# EAGLE design Board_v.03b (EAGLE 6.4)
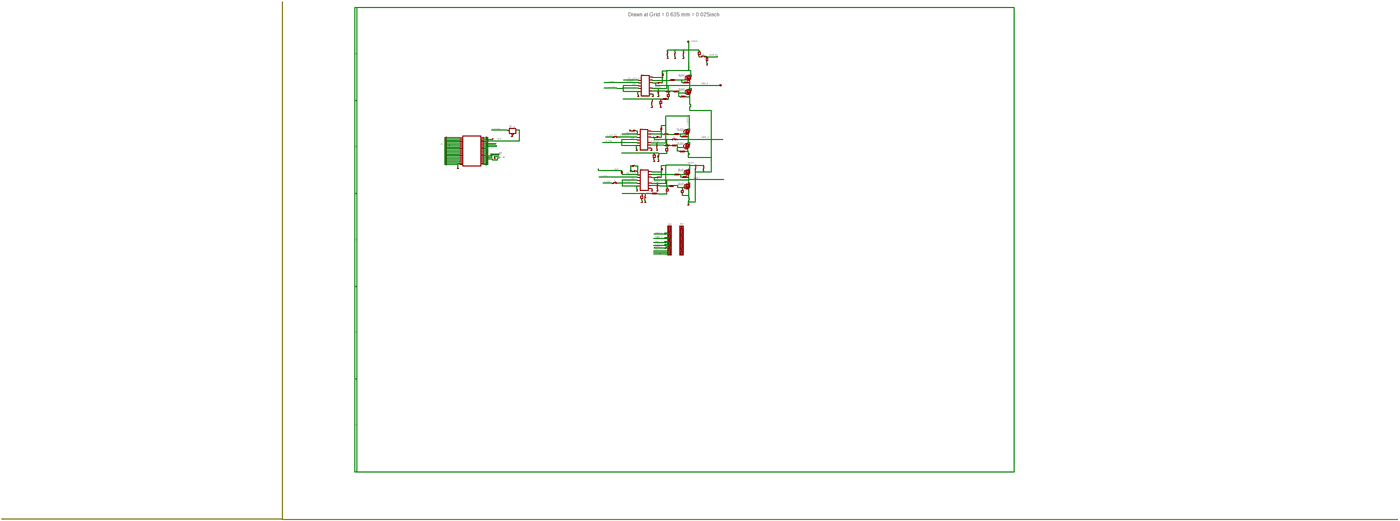
[diagram p0: schematic, sheet 1, overview]
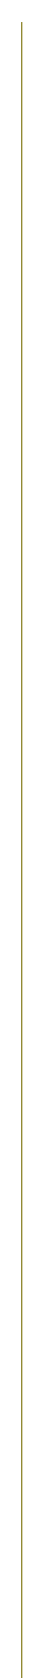
[diagram p1: schematic, sheet 1, part 1 of 7]
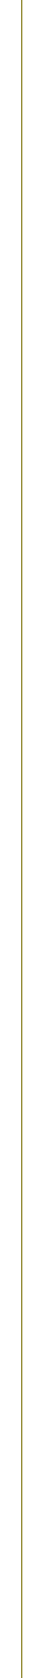
[diagram p2: schematic, sheet 1, part 2 of 7]
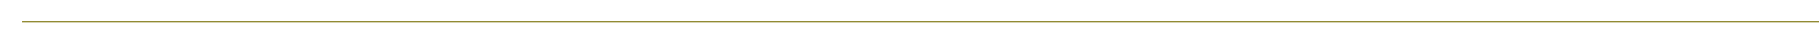
[diagram p3: schematic, sheet 1, part 3 of 7]
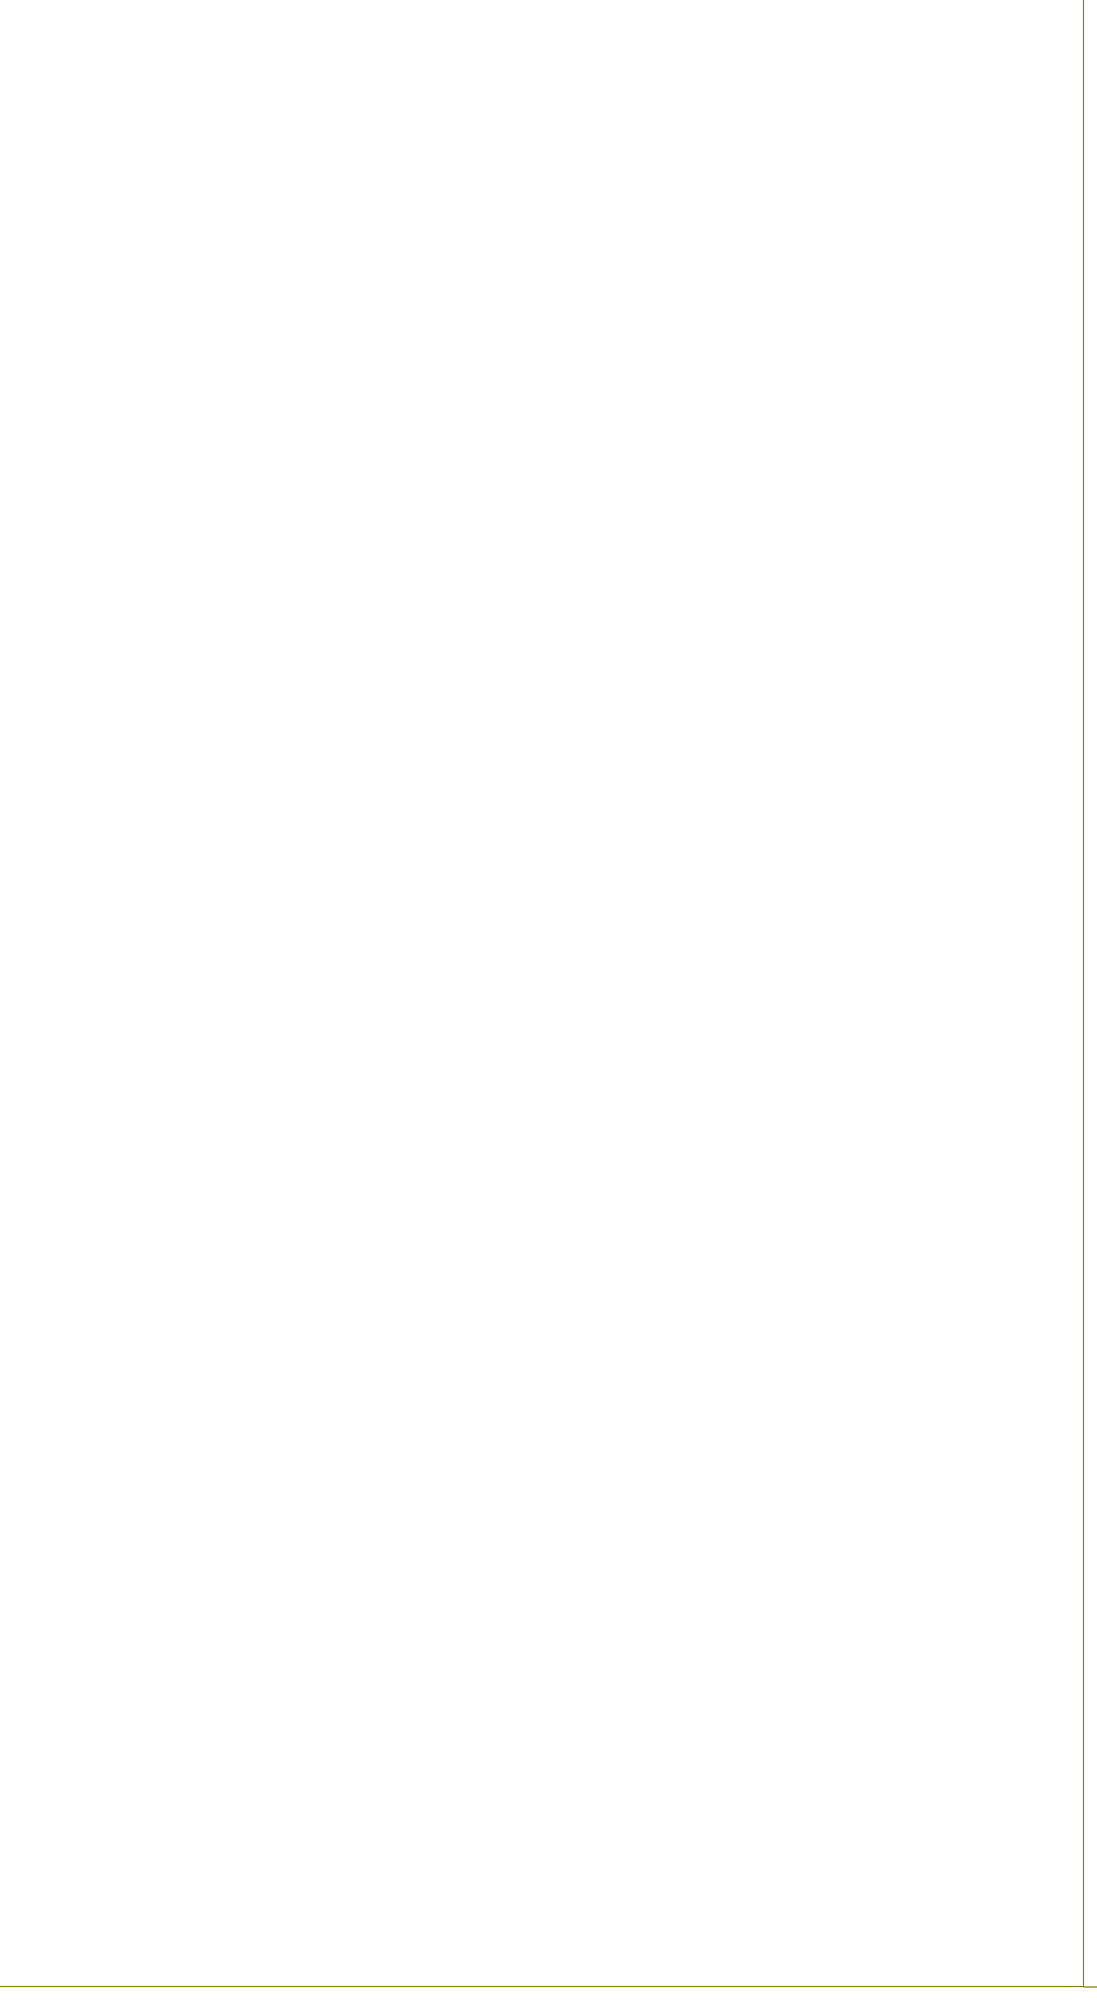
[diagram p4: schematic, sheet 1, part 4 of 7]
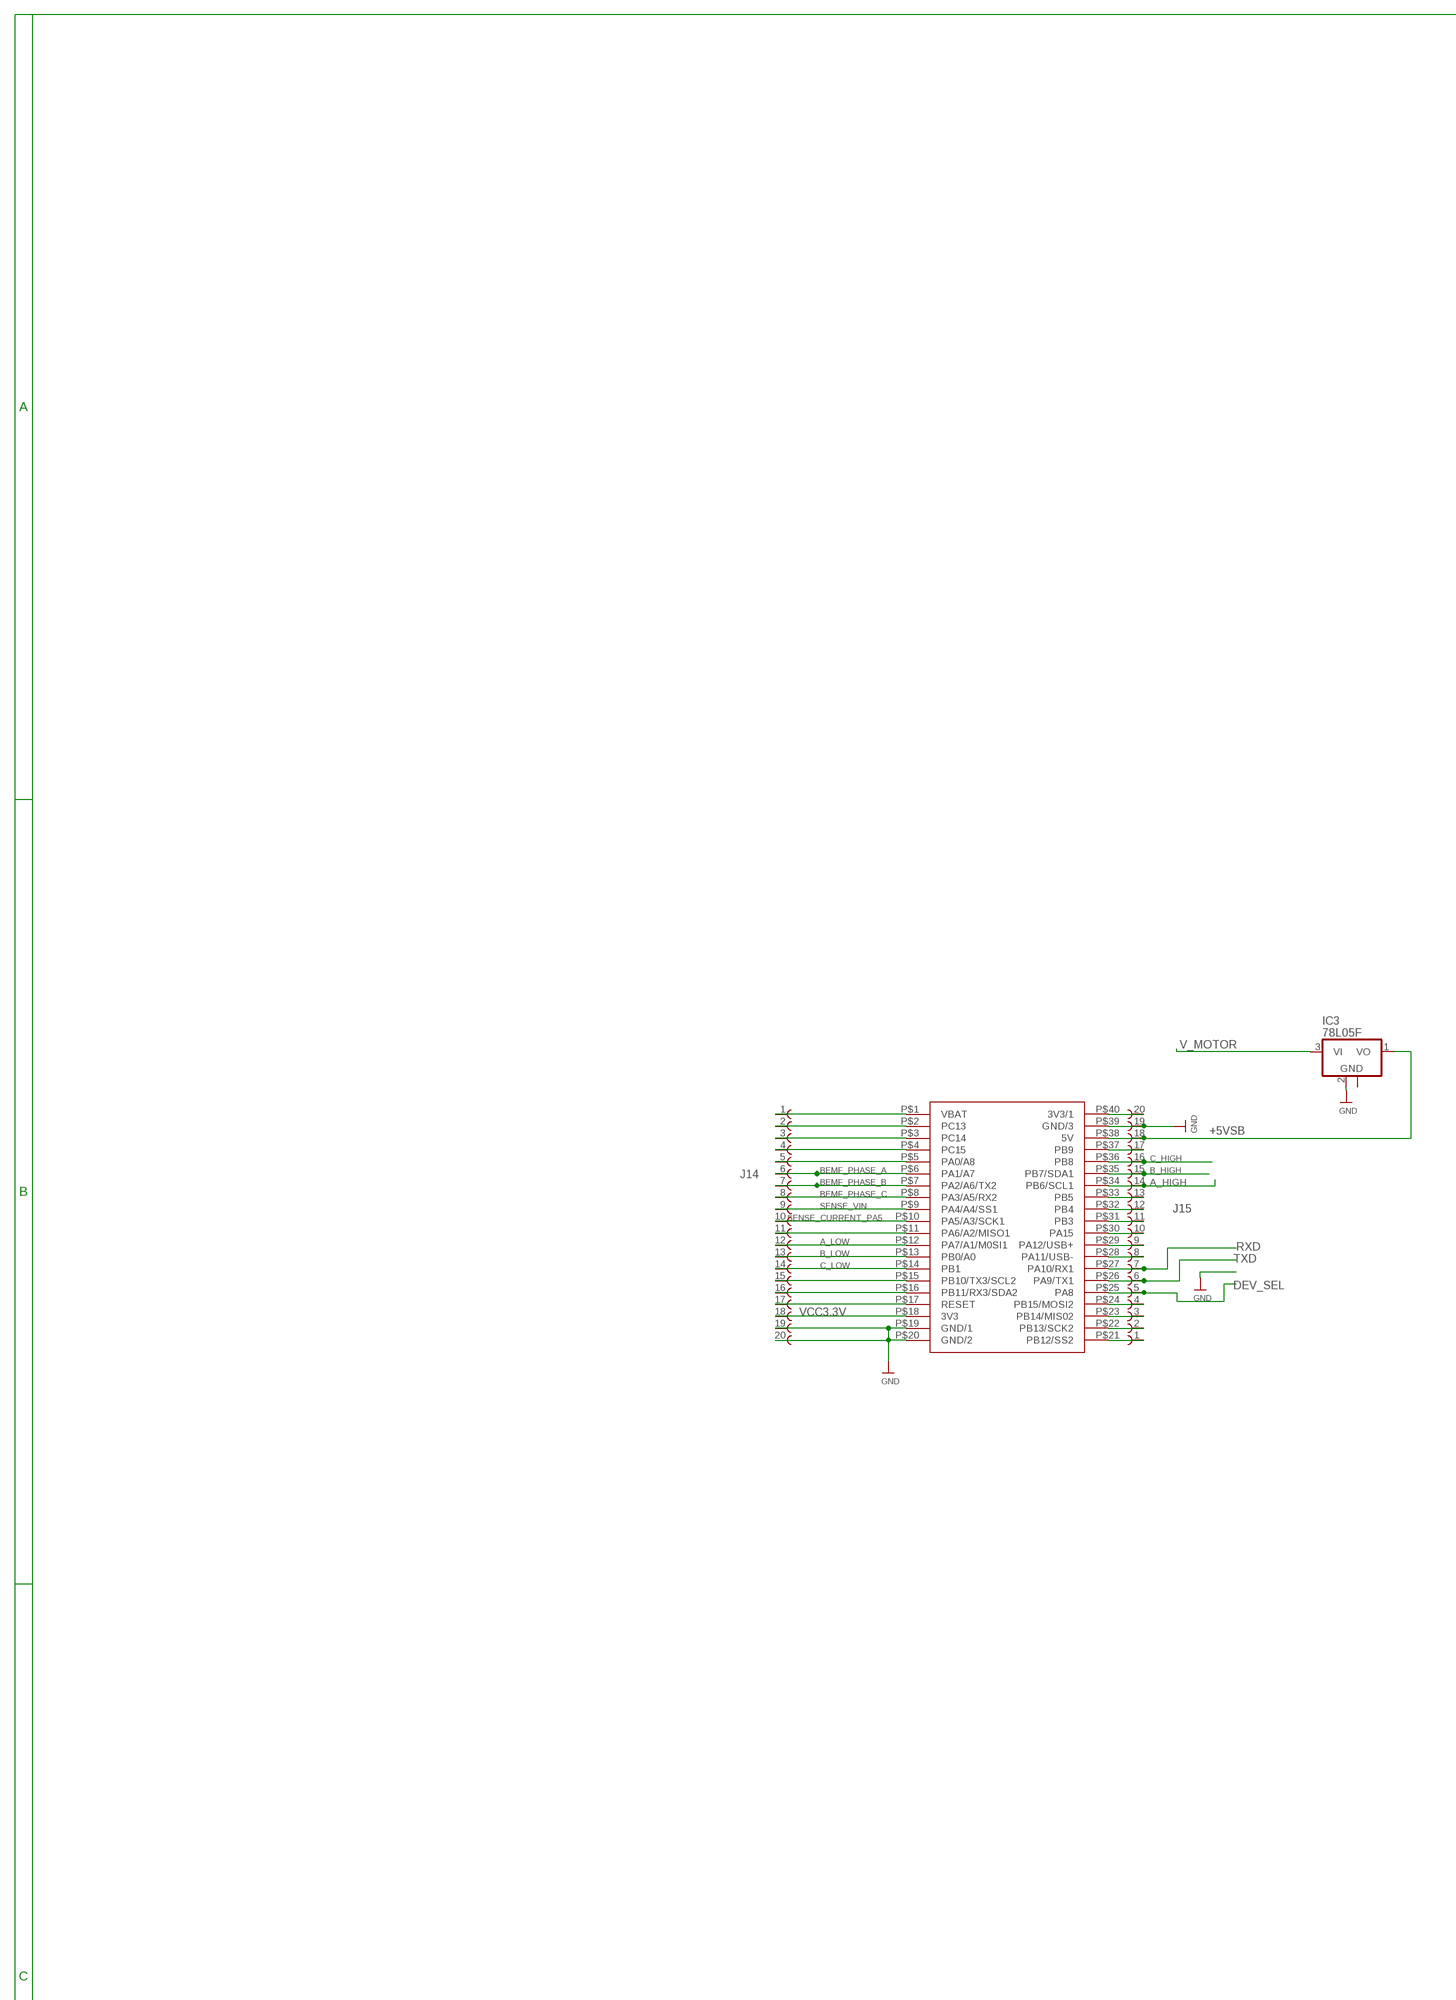
[diagram p5: schematic, sheet 1, part 5 of 7]
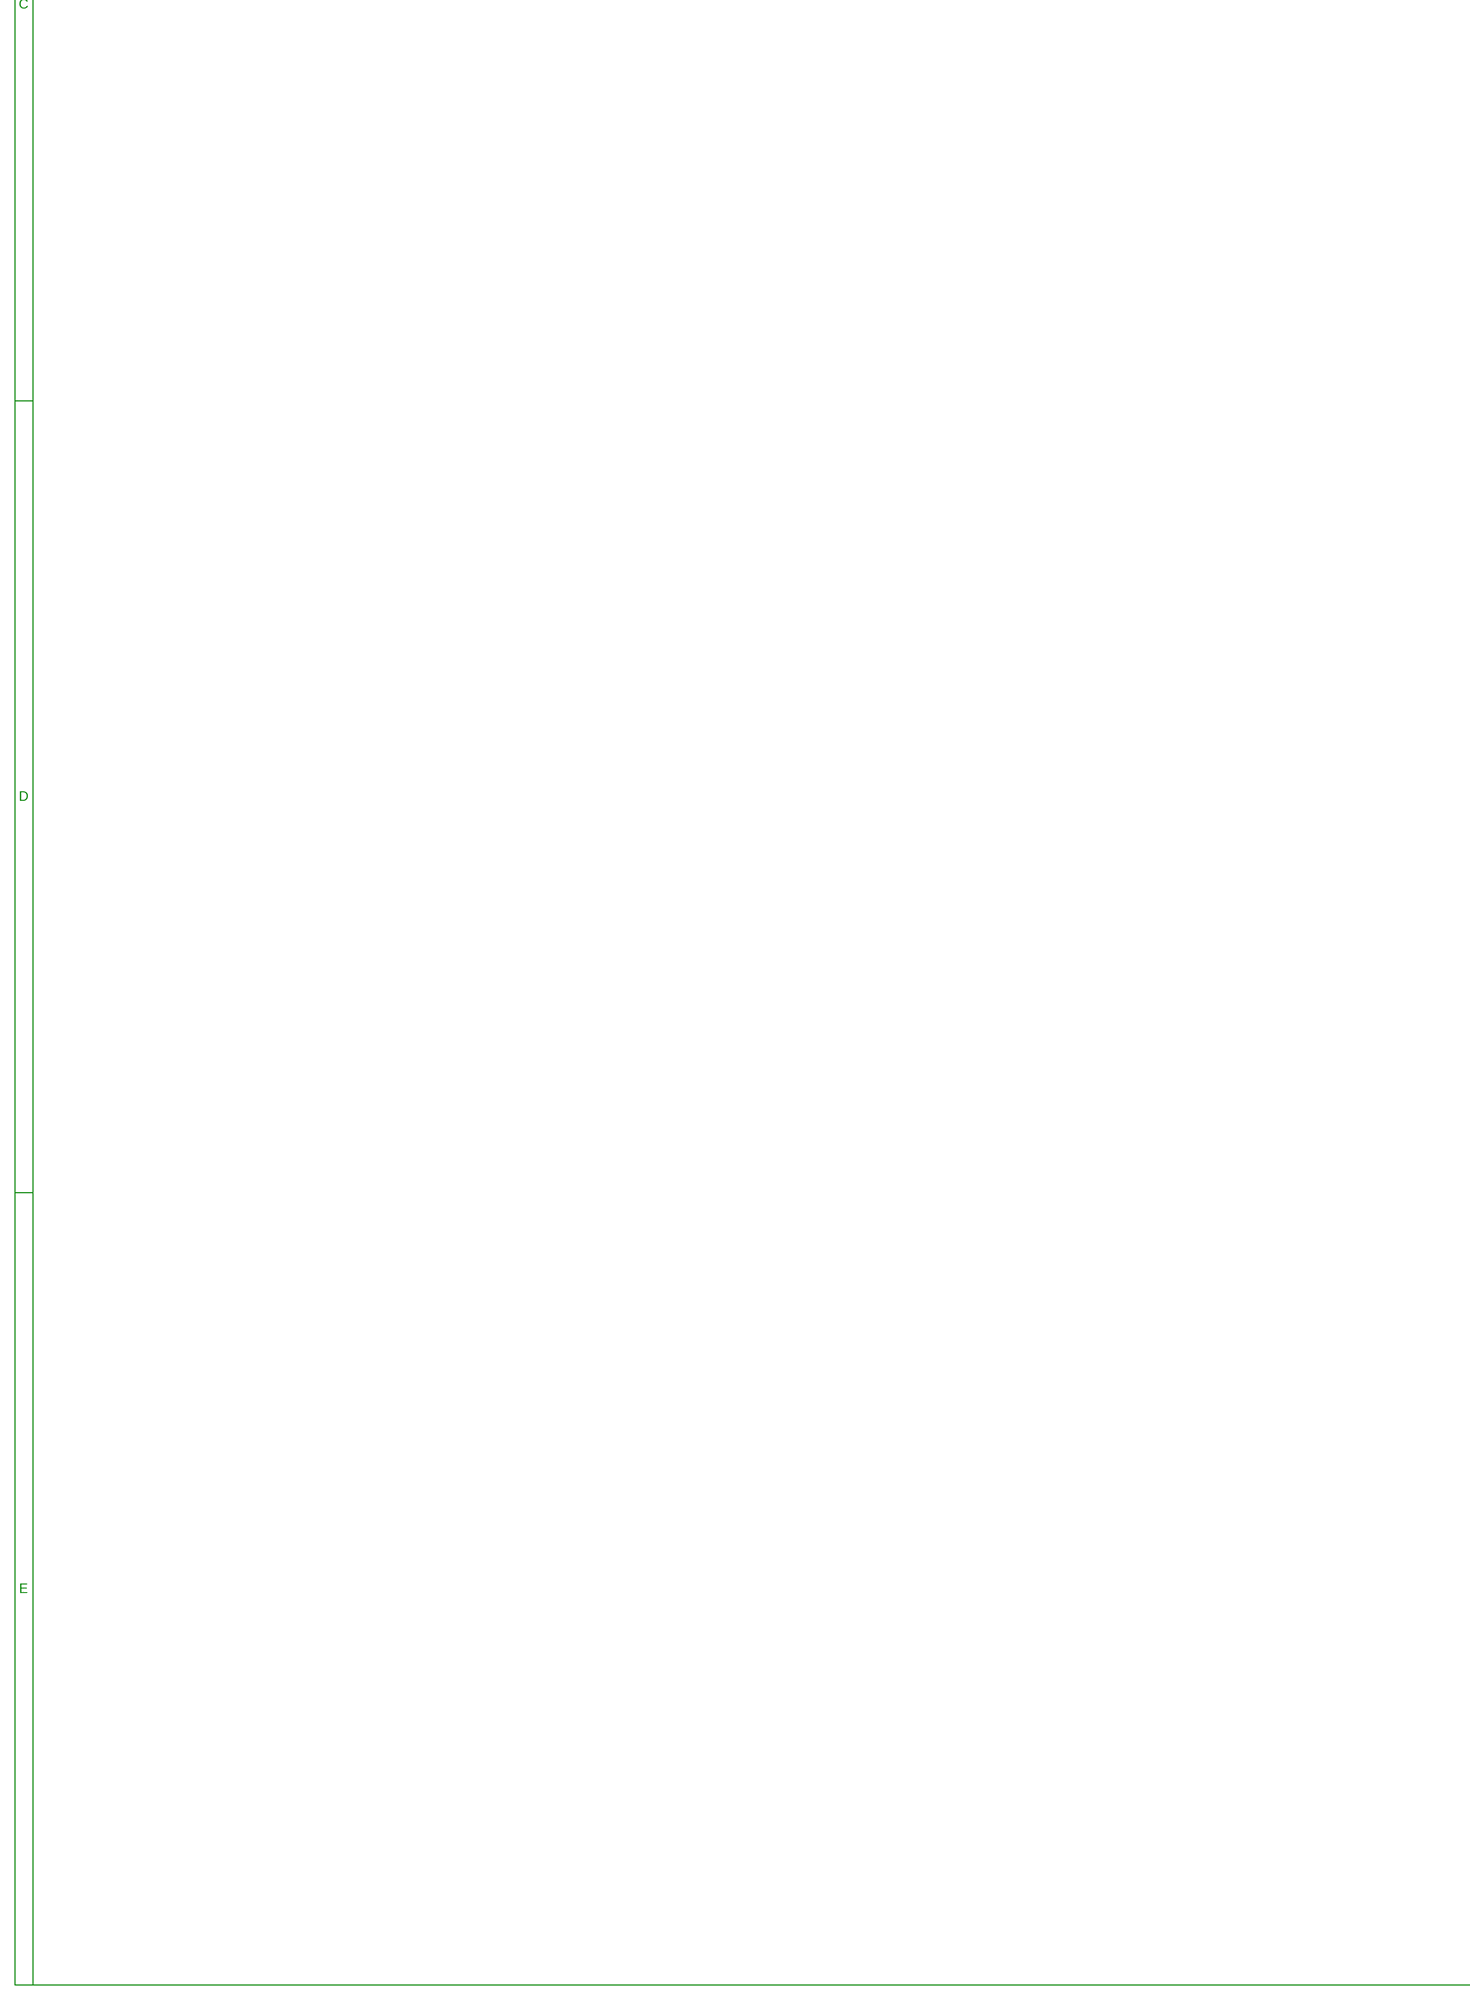
[diagram p6: schematic, sheet 1, part 6 of 7]
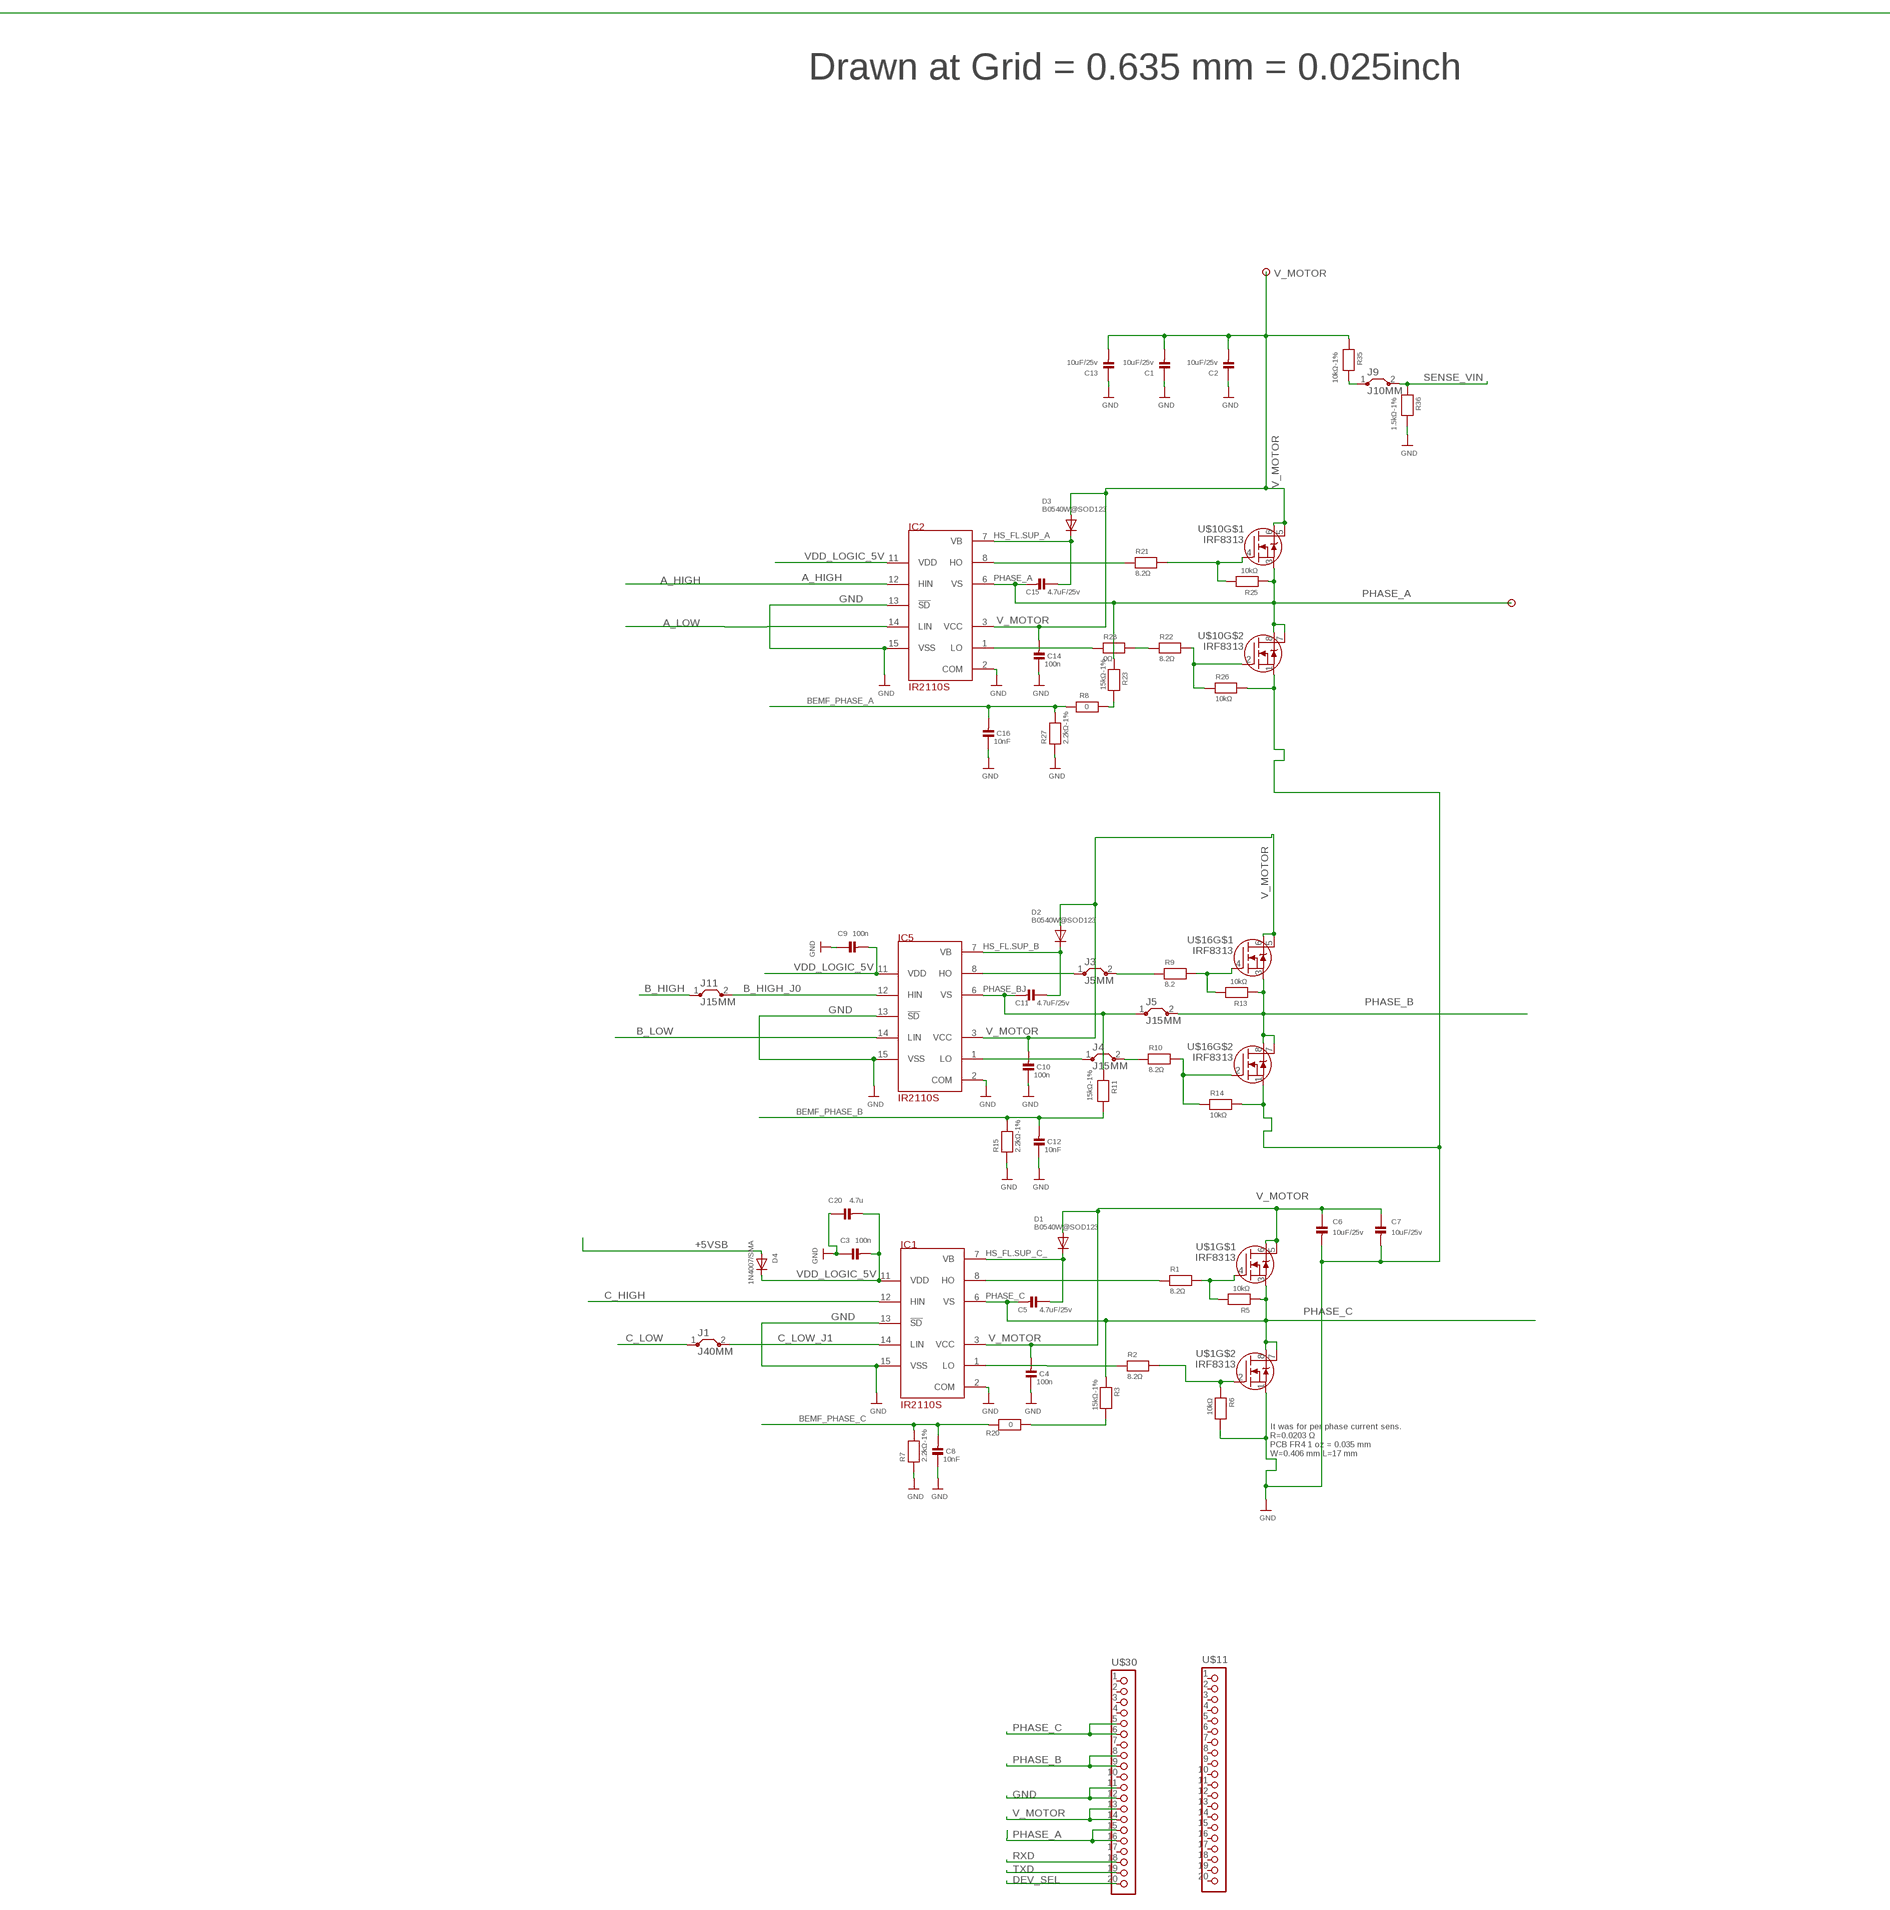
[diagram p7: schematic, sheet 1, part 7 of 7]

## Parts
C1  10uF/25v  CAP_CERAMIC_0805MP  [_0805MP]
C2  10uF/25v  CAP_CERAMIC_0805MP  [_0805MP]
C3  100n  CAP_CERAMIC_0805MP  [_0805MP]
C4  100n  CAP_CERAMIC_0603MP  [_0603MP]
C5  4.7uF/25v  CAP_CERAMIC_0805MP  [_0805MP]
C6  10uF/25v  CAP_CERAMIC_0805MP  [_0805MP]
C7  10uF/25v  CAP_CERAMIC_0805MP  [_0805MP]
C8  10nF  CAP_CERAMIC_0805MP  [_0805MP]
C9  100n  CAP_CERAMIC_0603MP  [_0603MP]
C10  100n  CAP_CERAMIC_0603MP  [_0603MP]
C11  4.7uF/25v  CAP_CERAMIC_0805MP  [_0805MP]
C12  10nF  CAP_CERAMIC_0805MP  [_0805MP]
C13  10uF/25v  CAP_CERAMIC_0805MP  [_0805MP]
C14  100n  CAP_CERAMIC_0603MP  [_0603MP]
C15  4.7uF/25v  CAP_CERAMIC_0805MP  [_0805MP]
C16  10nF  CAP_CERAMIC_0805MP  [_0805MP]
C20  4.7u  CAP_CERAMIC_0805MP  [_0805MP]
D1  B0540W@SOD123  DIODESOD-123  [SOD-123]
D2  B0540W@SOD123  DIODESOD-123  [SOD-123]
D3  B0540W@SOD123  DIODESOD-123  [SOD-123]
D4  1N4007/SMA  DIODESMA  [SMADIODE]
IC1  IR2110S  [SO-16DW]
IC2  IR2110S  [SO-16DW]
IC3  78L05F  [SOT89]
IC5  IR2110S  [SO-16DW]
J1  J40MM  [J40MM]
J3  J5MM  [05]
J4  J15MM  [15]
J5  J15MM  [15]
J9  J10MM  [10]
J11  J15MM  [15]
J14  61002013321  [CON-20PIN-SMD-MANUALLY-BENT-FROM-NON-SMD]
J15  61002013321  [CON-20PIN-SMD-MANUALLY-BENT-FROM-NON-SMD]
PHASE_C  PHASE_C  PAD  [PAD]
R1  8.2Ω  RESISTOR_0805MP  [_0805MP]
R2  8.2Ω  RESISTOR_0805MP  [_0805MP]
R3  15kΩ-1%  RESISTOR_0805MP  [_0805MP]
R5  10kΩ  RESISTOR_0805MP  [_0805MP]
R6  10kΩ  RESISTOR_0805MP  [_0805MP]
R7  2.2kΩ-1%  RESISTOR_0805MP  [_0805MP]
R8  0  RESISTOR_0805MP  [_0805MP]
R9  8.2  RESISTOR_0805MP  [_0805MP]
R10  8.2Ω  RESISTOR_0805MP  [_0805MP]
R11  15kΩ-1%  RESISTOR_0805MP  [_0805MP]
R13  10kΩ  RESISTOR_0805MP  [_0805MP]
R14  10kΩ  RESISTOR_0805MP  [_0805MP]
R15  2.2kΩ-1%  RESISTOR_0805MP  [_0805MP]
R20  0  RESISTOR_0805MP  [_0805MP]
R21  8.2Ω  RESISTOR_0805MP  [_0805MP]
R22  8.2Ω  RESISTOR_0805MP  [_0805MP]
R23  15kΩ-1%  RESISTOR_0805MP  [_0805MP]
R25  10kΩ  RESISTOR_0805MP  [_0805MP]
R26  10kΩ  RESISTOR_0805MP  [_0805MP]
R27  2.2kΩ-1%  RESISTOR_0805MP  [_0805MP]
R28  0Ω  RESISTOR_0805MP  [_0805MP]
R35  10kΩ-1%  RESISTOR_0805MP  [_0805MP]
R36  1.5kΩ-1%  RESISTOR_0805MP  [_0805MP]
U$1  IRF8313  [SO08]
U$10  IRF8313  [SO08]
U$11  CON_HEADER_1X20  [M1X20_SMD_2.54MM/0.1"_LONGTRACKS]
U$16  IRF8313  [SO08]
U$30  CON_HEADER_1X20  [M1X20_SMD_2.54MM/0.1"_LONGTRACKS]
U$36  BLUEPILL  [40-DIP-BLUE-PIL]
V_MOTOR  V_MOTOR  PAD  [PAD]

## Nets
+5VSB: D4.A IC3.1(VO) J15.18 U$36.P$38(5V)
A_HIGH: IC2.12(HIN) J15.14 U$36.P$34(PB6/SCL1)
A_LOW: IC2.14(LIN) J14.12 U$36.P$12(PA7/A1/M0SI1)
B_HIGH: J11.1 J15.15 U$36.P$35(PB7/SDA1)
B_HIGH_J0: IC5.12(HIN) J11.2
B_LOW: IC5.14(LIN) J14.13 U$36.P$13(PB0/A0)
BEMF_PHASE_A: C16.2 J14.6 R8.1 R27.2 U$36.P$6(PA1/A7)
BEMF_PHASE_B: C12.2 J14.7 R11.2 R15.2 U$36.P$7(PA2/A6/TX2)
BEMF_PHASE_C: C8.2 J14.8 R7.2 R20.2 U$36.P$8(PA3/A5/RX2)
C_HIGH: IC1.12(HIN) J15.16 U$36.P$36(PB8)
C_LOW: J1.1 J14.14 U$36.P$14(PB1)
C_LOW_J1: IC1.14(LIN) J1.2
DEV_SEL: J15.5 U$30.20 U$36.P$25(PA8)
GND: C1.1 C2.1 C3.1 C4.1 C6.2 C7.2 C8.1 C9.1 C10.1 C12.1 C13.1 C14.1 C16.1 C20.1 IC1.2(COM) IC1.13(!SD) IC1.15(VSS) IC2.2(COM) IC2.13(!SD) IC2.15(VSS) IC3.2(GND) IC5.2(COM) IC5.13(!SD) IC5.15(VSS) J14.19 J14.20 J15.19 R6.2 R7.1 R14.2 R15.1 R26.2 R27.1 R36.2 U$1.1(S) U$10.1(S) U$16.1(S) U$30.11 U$30.12 U$36.P$19(GND/1) U$36.P$20(GND/2) U$36.P$39(GND/3)
HS_FL.SUP_A: C15.1 D3.C IC2.7(VB)
HS_FL.SUP_B: C11.1 D2.C IC5.7(VB)
HS_FL.SUP_C_: C5.1 D1.C IC1.7(VB)
N$1: R1.2 R5.2 U$1.4(G)
N$2: J3.2 R9.1
N$3: R2.2 R6.1 U$1.2(G)
N$4: IC1.8(HO) R1.1
N$5: IC1.1(LO) R2.1
N$7: R8.2 R23.2
N$8: R3.2 R20.1
N$9: R9.2 R13.2 U$16.4(G)
N$10: IC5.8(HO) J3.1
N$11: R10.2 R14.1 U$16.2(G)
N$12: J4.2 R10.1
N$13: IC5.1(LO) J4.1
N$17: R21.2 R25.2 U$10.4(G)
N$18: R22.2 R26.1 U$10.2(G)
N$19: IC2.8(HO) R21.1
N$20: R22.1 R28.2
N$23: IC2.1(LO) R28.1
N$25: J14.5 U$36.P$5(PA0/A8)
N$27: J9.1 R35.2
N$34: J14.1 U$36.P$1(VBAT)
N$35: J14.2 U$36.P$2(PC13)
N$36: J14.3 U$36.P$3(PC14)
N$37: J14.4 U$36.P$4(PC15)
N$38: J14.11 U$36.P$11(PA6/A2/MISO1)
N$39: J14.15 U$36.P$15(PB10/TX3/SCL2)
N$40: J14.16 U$36.P$16(PB11/RX3/SDA2)
N$41: J14.17 U$36.P$17(RESET)
N$43: J15.1 U$36.P$21(PB12/SS2)
N$44: J15.2 U$36.P$22(PB13/SCK2)
N$45: J15.3 U$36.P$23(PB14/MIS02)
N$46: J15.4 U$36.P$24(PB15/MOSI2)
N$48: J15.8 U$36.P$28(PA11/USB-)
N$49: J15.9 U$36.P$29(PA12/USB+)
N$50: J15.10 U$36.P$30(PA15)
N$51: J15.11 U$36.P$31(PB3)
N$52: J15.12 U$36.P$32(PB4)
N$53: J15.13 U$36.P$33(PB5)
N$54: J15.17 U$36.P$37(PB9)
N$55: J15.20 U$36.P$40(3V3/1)
PHASE_A: C15.2 IC2.6(VS) PHASE_C.1 R23.1 R25.1 U$10.3(S) U$10.7(D) U$10.8(D) U$30.15 U$30.16
PHASE_B: J5.2 R13.1 U$16.3(S) U$16.7(D) U$16.8(D) U$30.8 U$30.9
PHASE_BJ: C11.2 IC5.6(VS) J5.1 R11.1
PHASE_C: C5.2 IC1.6(VS) R3.1 R5.1 U$1.3(S) U$1.7(D) U$1.8(D) U$30.5 U$30.6
RXD: J15.7 U$30.18 U$36.P$27(PA10/RX1)
SENSE_CURRENT_PA5: J14.10 U$36.P$10(PA5/A3/SCK1)
SENSE_VIN: J9.2 J14.9 R36.1 U$36.P$9(PA4/A4/SS1)
TXD: J15.6 U$30.19 U$36.P$26(PA9/TX1)
V_MOTOR: C1.2 C2.2 C4.2 C6.1 C7.1 C10.2 C13.2 C14.2 D1.A D2.A D3.A IC1.3(VCC) IC2.3(VCC) IC3.3(VI) IC5.3(VCC) R35.1 U$1.5(D) U$1.6(D) U$10.5(D) U$10.6(D) U$16.5(D) U$16.6(D) U$30.13 U$30.14 V_MOTOR.1
VCC3.3V: J14.18 U$36.P$18(3V3)
VDD_LOGIC_5V: C3.2 C9.2 C20.2 D4.C IC1.11(VDD) IC2.11(VDD) IC5.11(VDD)
Unconnected: IC3.2@1(GND) U$11.1 U$11.2 U$11.3 U$11.4 U$11.5 U$11.6 U$11.7 U$11.8 U$11.9 U$11.10 U$11.11 U$11.12 U$11.13 U$11.14 U$11.15 U$11.16 U$11.17 U$11.18 U$11.19 U$11.20 U$30.1 U$30.2 U$30.3 U$30.4 U$30.7 U$30.10 U$30.17

## Notes on the sheet
- Drawn at Grid = 0.635 mm = 0.025inch
- It was for per phase current sens.
  R=0.0203 Ω 
  PCB FR4 1 oz = 0.035 mm
  W=0.406 mm L=17 mm

## Library data of the parts
C1-C16 C20 = microbuilder:CAP_CERAMIC: Ceramic Capacitors 0402 - 0402 Surface Mount Capacitors 16pF 50V 5% [Digikey: 445-4899-2-ND] 18pF 50V 5% [Digikey: 490-1281-2-ND] 22pF 50V 5% [Digikey: 490-1283-2-ND] 68pF 50V 5% [Digikey: 490-1289-2-ND] 0.1uF 10V 10% [Digikey: 490-1318-2-ND] 1.0uF 6.3V 10% [Digikey: 490-1320-2-ND] 0603 - 0603 Surface Mount Capacitors 16 pF 50V 5% [Digikey: 445-5051-2-ND] 22 pF 50V [Digikey: PCC220ACVTR-ND] 33 pF 50V 5% [Digikey: 490-1415-1-ND] 56pF 50V 5% [Digikey: 490-1421-1-ND] 220pF 50V 5% [Digikey: 445-1285-1-ND] 680 pF 50V 2200 pF 50V 5% C0G [Digikey: 445-1297-1-ND] 5600 pF 100V 5% X7R [Digikey: 478-3711-1-ND] 0.1 µF 25V 10% [Digikey: PCC2277TR-ND] 0.22 µF 16V 10% X7R [Digikey: 445-1318-1-ND] 1.0 µF 25V 10% [Digikey: 445-5146-2-ND] 0603 - RF Specific 3pF 250V +/-0.1pF RF [Digikey: 712-1347-1-ND] 18 pF 250V 5% [Digikey: 478-3505-1-ND or 712-1322-1-ND] 56 pF 250V 5% C0G RF [Digikey: 490-4867-1-ND] 68 pF 250V RF [Digikey: 490-4868-1-ND] 0805 - 0805 Surface Mount Capacitors 220 pF 250V 2% RF Ceramic Capacitor [Digikey: 712-1398-1-ND] 1000 pF 50V 2% NP0 Ceramic Capacitor [Digikey: 478-3760-1-ND] 0.1 µF 25V 10% Ceramic Capacitor [Digikey: PCC1828TR-ND] 1.0 µF 16V 10% Ceramic Capacitor[Digikey: 490-1691-2-ND] 10.0 µF 10V 10% Ceramic Capacitor[Digikey: 709-1228-1-ND] 10.0 uF 16V 10% Ceramic Capacitor [Digikey: 478-5165-2-ND] 47 uF 6.3V 20% Ceramic Capacitor [Digikey: 587-1779-1-ND or 399-5506-1-ND] 1206 - 1206 Surface Mount Capacitors 47uF 10V 20% Ceramic Capacitor [Digikey: 490-5528-1-ND or 399-5508-1-ND or 445-6010-1-ND] 100uF 6.3V -20%, +80% Y5V Ceramic Capacitor (Digikey: 490-4512-1-ND, Mouser: 81-GRM31CF50J107ZE1L)
D1-D4 = adafruit[some parts from microbuilder.eu]:DIODE: Diode SMADIODE - SMA Surface Mount Package 20V 1A Schottky Diode Digikey: 641-1014-6-ND DO-1N4148 - Through Hole Small Current Diode SOD-123 20V 1 A (.5mV Vf) Schottky Diode - Digikey: MBRX120TPMSCT-ND SOD-323 10V 570mA (.38mV Vf, 3ns) Schottky Diode - Digikey: ZLLS410CT-ND SOD-523 30V 30mA Schottky Diode (RB751S-40TE61) - Digikey: RB751S-40TE61CT-ND SOT23-R/W - SOT23 Package (R = Solder Paste/Reflow Ovens, W = Hand-Soldering) BAT54Film 40V 300mA - Digikey: 497-7162-1-ND
IC1 IC2 IC5 = Gele_v05:IR2110
IC3 = linear:78L*: POSITOIV-VOLTAGE REGULATORS Output up to 100 mA Source: http://focus.ti.com/lit/ds/symlink/ua78l05.pdf
J1 = Gele_v04:J: Bridge/ jumper
J3-J5 J9 J11 = jumper:J: Bridge
J14 J15 = Gele_v05:61002013321: 2.54mm SMT Socket Header, 20 Pins, hand-bent from non-smd part=>
PHASE_C V_MOTOR = SteveMarple:PAD
R1-R3 R5-R11 R13-R15 R20-R23 R25-R28 R35 R36 = microbuilder:RESISTOR: Resistors 0402 - 0402 Surface Mount Package 22 Ohm 1% 1/16W [Digikey: 311-22.0LRTR-ND] 33 Ohm 5% 1/16W 1.0K 5% 1/16W 1.5K 5% 1/16W 2.0K 1% 1/16W 10.0K 1% 1/16W [Digikey: 311-10.0KLRTR-ND] 10.0K 5% 1/16W [Digikey: RMCF0402JT10K0TR-ND] 12.1K 1% 1/16W [Digikey: 311-22.0LRTR-ND] 100.0K 5% 1/16W 0603 - 0603 Surface Mount Package 0 Ohm 1/10 Watt 1% Resistor 15 Ohm 1/10 Watt 1% Resistor 33 Ohm 1/10 Watt 1% Resistor 49.9 Ohm 1/10 Watt 1% Resistor 100 Ohm 1/10 Watt 1% Resistor 150 Ohm 1/10 Watt 1% Resistor 240 Ohm 1/10 Watt 1% Resistor 390 Ohm 1/10 Watt 1% Resistor 560 Ohm 1/10 Watt 1% Resistor 680 Ohm 1/10 Watt 1% Resistor 750 Ohm 1/10 Watt 1% Resistor 1.0K Ohm 1/10 Watt 1% Resistor 1.5K Ohm 1/10 Watt 1% Resistor 2.0K Ohm 1/10 Watt 1% Resistor 2.2K Ohm 1/10 Watt 1% Resistor 3.3K Ohm 1/10 Watt 1% Resistor 4.7K Ohm 1/10 Watt 1% Resistor 10.0K Ohm 1/10 Watt 1% Resistor 12.0K Ohm 1/10 Watt 1% Resistor 12.1K Ohm 1/10 Watt 1% Resistor 20.0K Ohm 1/10 Watt 1% Resistor 33.0K Ohm 1/10 Watt 1% Resistor 100.0K Ohm 1/10 Watt 1% Resistor 0805 - 0805 Surface Mount Package 0 Ohm 1/8 Watt 1% Resistor 33 Ohm 1/8 Watt 1% Resistor 100 Ohm 1/8 Watt 1% Resistor 150 Ohm 1/8 Watt 1% Resistor 200 Ohm 1/8 Watt 1% Resistor 240 Ohm 1/8 Watt 1% Resistor 330 Ohm 1/8 Watt 1% Resistor 390 Ohm 1/8 Watt 1% Resistor 470 Ohm 1/8 Watt 1% Resistor 1.0K Ohm 1/8 Watt 1% Resistor 1.5K Ohm 1/8 Watt 1% Resistor 2.0K Ohm 1/8 Watt 1% Resistor 4.7K Ohm 1/8 Watt 1% Resistor 5.1K Ohm 1/8 Watt 1% Resistor 5.6K Ohm 1/8 Watt 1% Resistor 10.0K Ohm 1/8 Watt 1% Resistor 22.0K Ohm 1/8 Watt 1% Resistor 33.0K Ohm 1/8 Watt 1% Resistor 100K Ohm 1/8 Watt 1% Resistor 1206 - 1206 Surface Mount Package 2012 - 2010 Surface Mount Package 0.11 Ohm 1/2 Watt 1% Resistor - Digikey: RHM.11UCT-ND
U$1 U$10 U$16 = Misc_HEXFET_Transistors:IRF8313: Dual N-Channel HEXFET® Power MOSFET Applications Load Switch DC/DC Converters Benefits Low Gate Charge and Low RDS(on) Fully Characterized Avalanche Voltage and Current 20V VGS Max. Gate Rating 100% Tested for RG Lead-Free (Qualified to 260°C Reflow) RoHS Compliant (Halogen Free) RDS(ON) 12.5mΩ @VGS = 10V 18.6mΩ @VGS = 4.5V Maximum Ratings VGS = 20V VDS = 30V IDS = 9.7A
U$11 U$30 = Gele.tmp:CON_HEADER_1X20
U$36 = maplemini:BLUEPILL

## Board
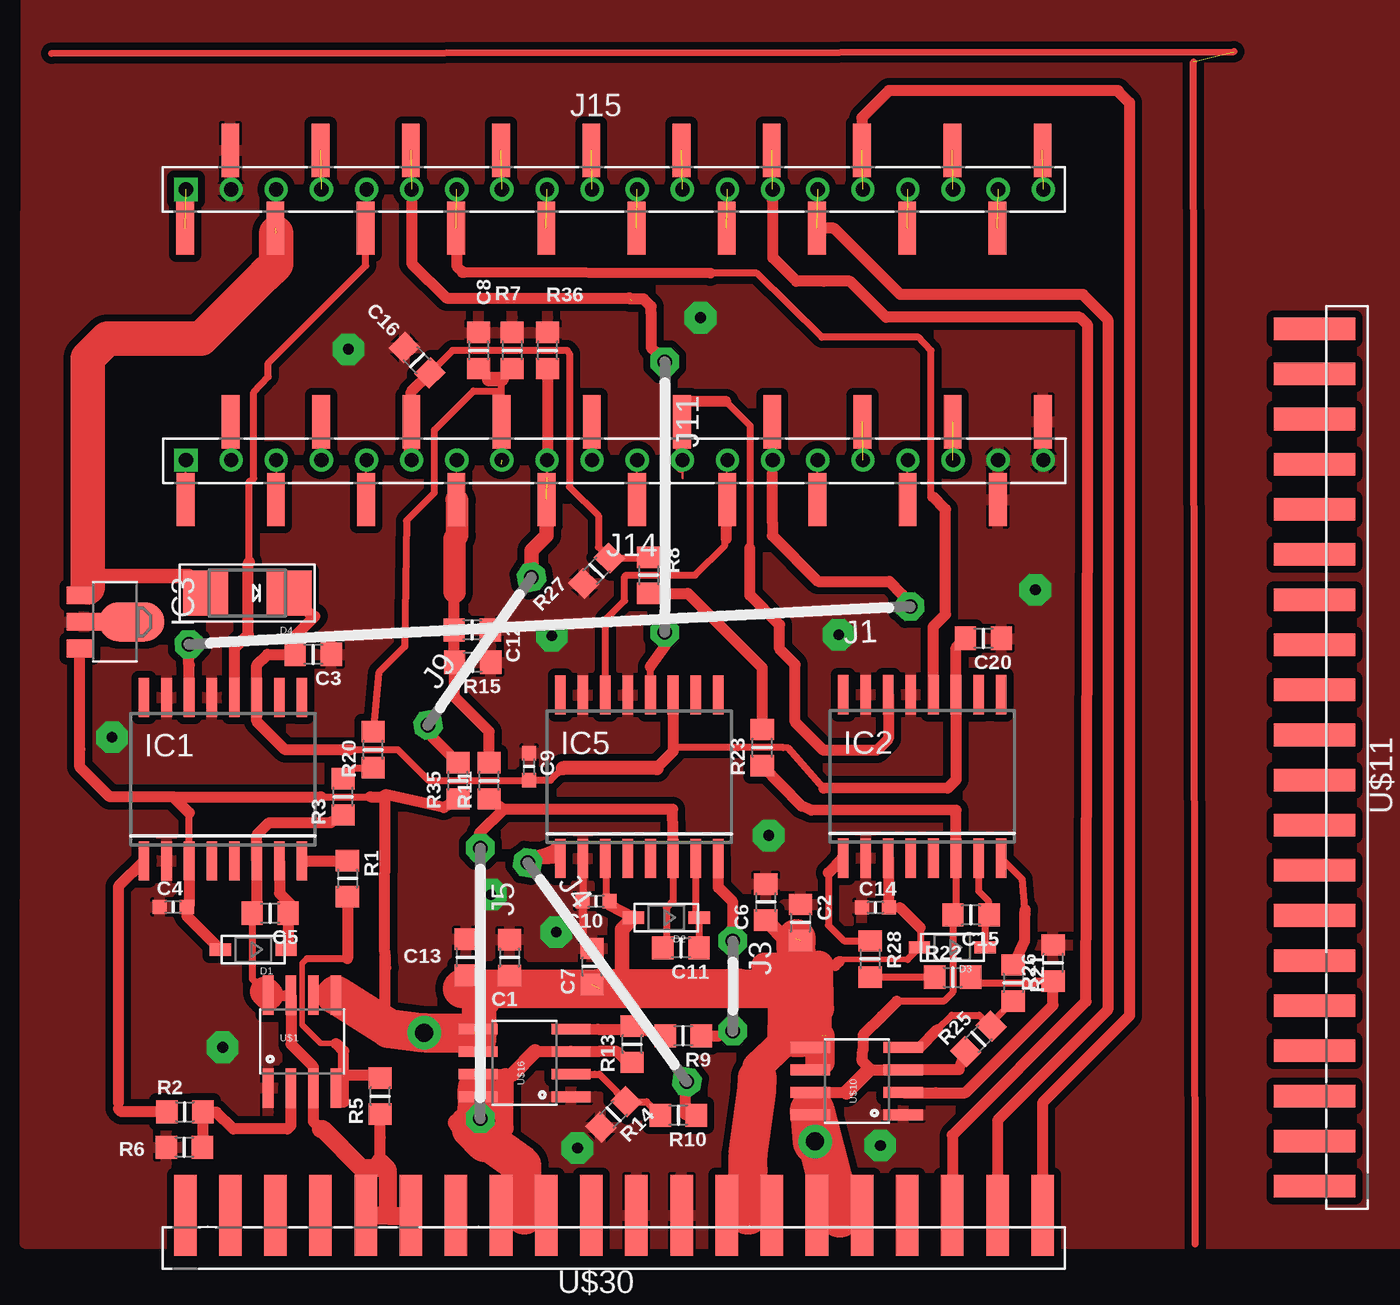
[diagram p8: board, top side]
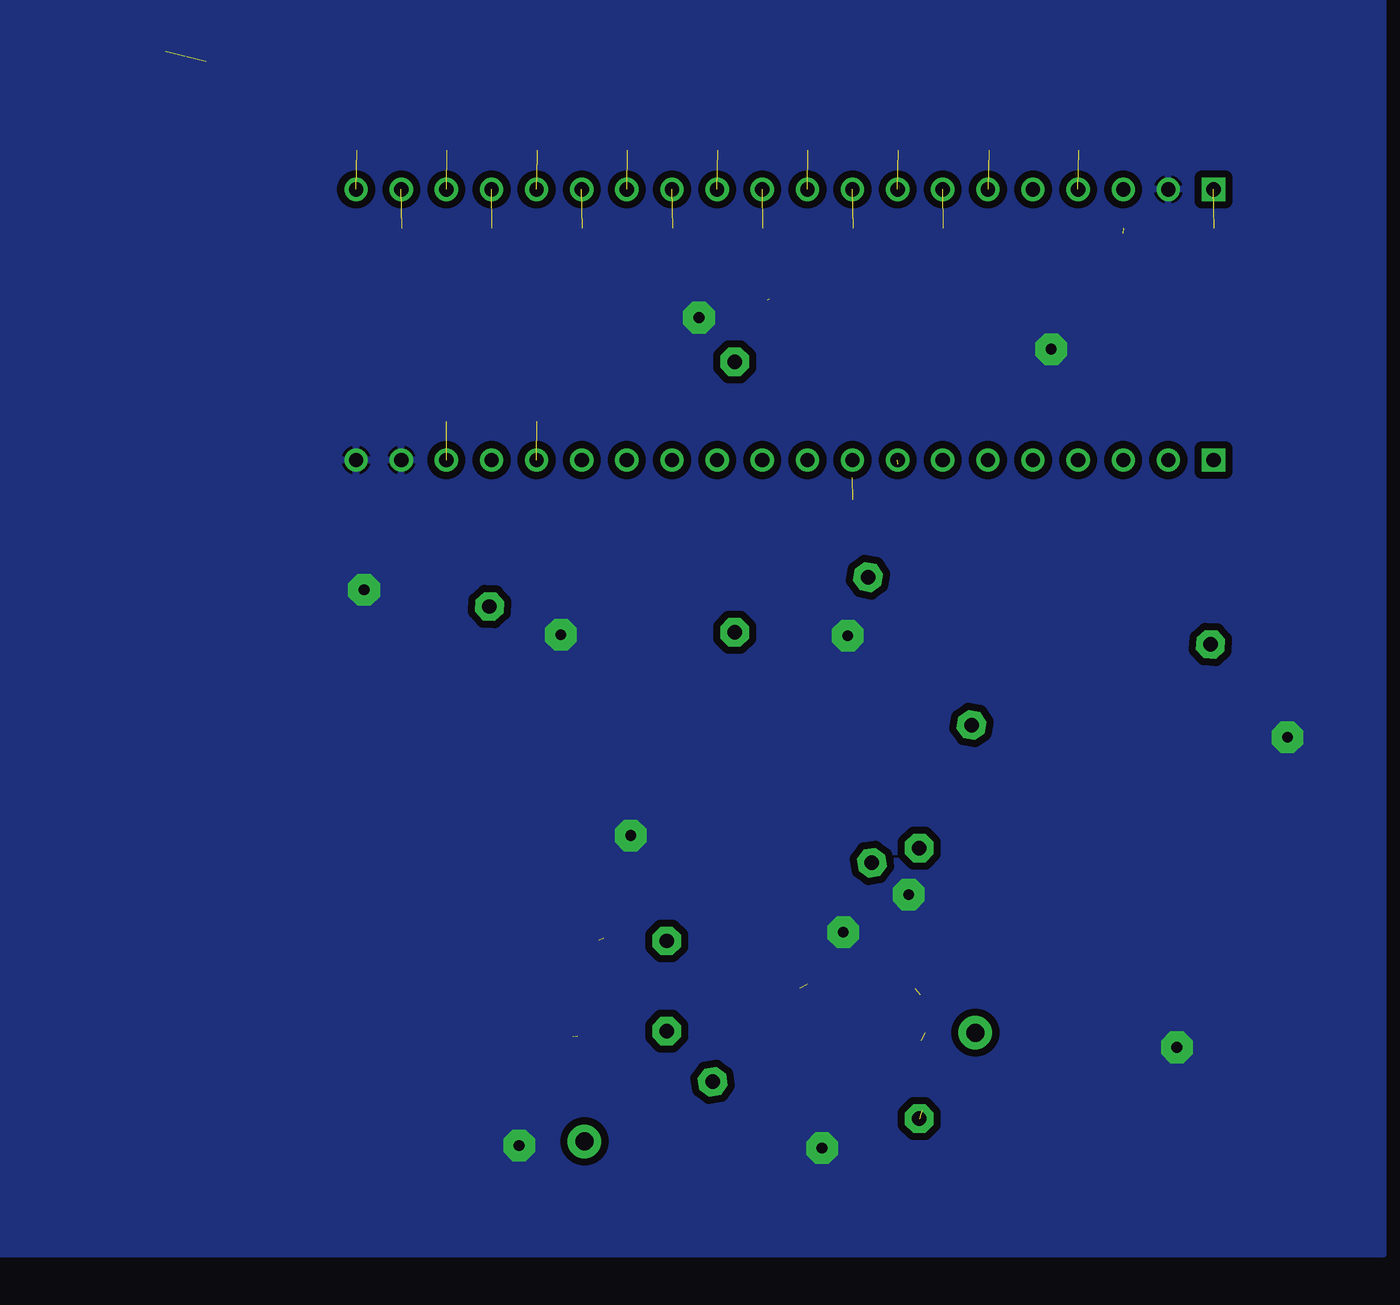
[diagram p9: board, bottom side, seen from below]

No outline drawn. Coordinates in mm, seen from the top.
Copper layers (1*16): Top 0.035mm / dielectric 1.5mm / Bottom 0.035mm
Design rules "default *": minimum track width 0.25mm, minimum drill 24mil, track to track 16mil, track to pad 8mil, pad to pad 8mil, via to via 8mil, smd to smd 8mil, copper to edge 40mil, drill to drill 0.6mm, minimum pad ring 10mil, minimum via ring 8mil, stop-mask expansion 4mil, vias tented up to drill 0mil, thermal gap 6mil

### Footprints (pad centres in the part's own frame; a part is rotated, then mirrored left to right if it is on the bottom)
_0805MP = smd 1.2 x 1.3: 1 -1.016,0; 2 1.016,0
_0603MP = smd 0.8 x 0.8: 1 -0.762,0; 2 0.762,0
SOD-123 = smd 1.2 x 0.7: A 1.85,0; C -1.85,0
SMADIODE = smd 2.54 x 2.54: A 2.349,0; C -2.349,0
SO-16DW = smd 0.6 x 2.2: 1 -4.445,-4.6; 2 -3.175,-4.6; 3 -1.905,-4.6; 4 -0.635,-4.6; 5 0.635,-4.6; 6 1.905,-4.6; 7 3.175,-4.6; 8 4.445,-4.6; 9 4.445,4.6; 10 3.175,4.6; 11 1.905,4.6; 12 0.635,4.6; 13 -0.635,4.6; 14 -1.905,4.6; 15 -3.175,4.6; 16 -4.445,4.6
SOT89 = smd 1 x 1.5: 1 -1.499,-1.981; 3 1.499,-1.981 | smd 1 x 2: 2 0,-1.727 | smd 2.2 x 3.7: 2@1 0,0.94
J40MM = drill 0.813 pad 1.6 octagon: 1 -20.32,0; 2 20.32,0
05 = drill 0.813 pad 1.6 octagon: 1 -2.54,0; 2 2.54,0
15 = drill 0.813 pad 1.6 octagon: 1 -7.62,0; 2 7.62,0
10 = drill 0.813 pad 1.6 octagon: 1 -5.08,0; 2 5.08,0
CON-20PIN-SMD-MANUALLY-BENT-FROM-NON-SMD = smd 1 x 3: 1 24.13,2.19; 2 21.59,-2.19; 3 19.05,2.19; 4 16.51,-2.19; 5 13.97,2.19; 6 11.43,-2.19; 7 8.89,2.19; 8 6.35,-2.19; 9 3.81,2.19; 10 1.27,-2.19; 11 -1.27,2.19; 12 -3.81,-2.19; 13 -6.35,2.19; 14 -8.89,-2.19; 15 -11.43,2.19; 16 -13.97,-2.19; 17 -16.51,2.19; 18 -19.05,-2.19; 19 -21.59,2.19; 20 -24.13,-2.19
PAD = drill 1.016 pad 1.88: 1 0,0
SO08 = smd 0.61 x 2.21: 1 -1.905,-2.616; 2 -0.635,-2.616; 3 0.635,-2.616; 4 1.905,-2.616; 5 1.905,2.616; 6 0.635,2.616; 7 -0.635,2.616; 8 -1.905,2.616
M1X20_SMD_2.54MM/0.1"_LONGTRACKS = smd 1.27 x 4.572: 1 -24.13,0.573; 2 -21.59,0.573; 3 -19.05,0.573; 4 -16.51,0.573; 5 -13.97,0.573; 6 -11.43,0.573; 7 -8.89,0.573; 8 -6.35,0.573; 9 -3.81,0.573; 10 -1.27,0.573; 11 1.27,0.573; 12 3.81,0.573; 13 6.35,0.573; 14 8.89,0.573; 15 11.43,0.573; 16 13.97,0.573; 17 16.51,0.573; 18 19.05,0.573; 19 21.59,0.573; 20 24.13,0.573
MOUNTINGHOLE_2.8 = hole 2.8: 0,0
40-DIP-BLUE-PIL = drill 0.8 square: P$1 -7.62,22.86; P$40 7.62,22.86 | drill 0.8: P$2 -7.62,20.32; P$3 -7.62,17.78; P$4 -7.62,15.24; P$5 -7.62,12.7; P$6 -7.62,10.16; P$7 -7.62,7.62; P$8 -7.62,5.08; P$9 -7.62,2.54; P$10 -7.62,0; P$11 -7.62,-2.54; P$12 -7.62,-5.08; P$13 -7.62,-7.62; P$14 -7.62,-10.16; P$15 -7.62,-12.7; P$16 -7.62,-15.24; P$17 -7.62,-17.78; P$18 -7.62,-20.32; P$19 -7.62,-22.86; P$20 -7.62,-25.4; P$21 7.62,-25.4; P$22 7.62,-22.86; P$23 7.62,-20.32; P$24 7.62,-17.78; P$25 7.62,-15.24; P$26 7.62,-12.7; P$27 7.62,-10.16; P$28 7.62,-7.62; P$29 7.62,-5.08; P$30 7.62,-2.54; P$31 7.62,0; P$32 7.62,2.54; P$33 7.62,5.08; P$34 7.62,7.62; P$35 7.62,10.16; P$36 7.62,12.7; P$37 7.62,15.24; P$38 7.62,17.78; P$39 7.62,20.32

### Placement (x,y rotation side)
C1  27.77,16.68 270 top
C2  44.15,18.65 270 top
C3  16.73,33.75 180 top
C4  8.85,19.52 0 top
C5  14.3,19.18 180 top
C6  42.2,19.8 90 top
C7  32.42,16.18 90 top
C8  26.02,50.85 270 top
C9  28.88,27.43 270 top
C10  32.65,19.85 0 top
C11  37.42,17.23 180 top
C12  25.68,35.12 180 top
C13  25.32,16.7 270 top
C14  48.38,19.5 0 top
C15  53.75,19.07 180 top
C16  22.57,50.3 315 top
C20  54.45,34.65 180 top
D1  13.35,17.12 180 top
D2  36.6,18.93 180 top
D3  52.7,17.25 180 top
D4  13.03,37.2 180 top
IC1  11.65,26.73 0 top
IC2  51,26.88 0 top
IC3  5.58,35.58 270 top
IC5  35.08,26.85 0 top
J1  30.02,35.38 183 top
J3  40.35,15.07 270 top
J4  33.27,15.85 306 top
J5  26.12,15.22 270 top
J9  26.1,33.92 55 top
J11  36.52,42.6 270 top
J14  33.67,44.65 180 top
J15  33.65,59.92 0 top
PHASE_C  44.98,6.33 0 top
R1  18.65,21.12 270 top
R2  9.5,8 0 top
R3  18.4,25.73 90 top
R5  20.5,8.88 90 top
R6  9.47,6 180 top
R7  27.93,50.85 270 top
R8  35.6,38.2 270 top
R9  37.55,12.28 180 top
R10  37.27,7.8 180 top
R11  26.62,26.62 90 top
R13  34.67,11.8 90 top
R14  33.62,7.85 225 top
R15  25.7,33.3 180 top
R20  20.1,28.38 90 top
R21  56.12,15.25 270 top
R22  52.73,15.57 0 top
R23  42,28.5 90 top
R25  54.17,12.1 45 top
R26  58.38,16.38 90 top
R27  32.67,38.45 45 top
R28  48.08,16.6 270 top
R35  24.88,26.62 90 top
R36  29.93,50.85 90 top
U$1  16.1,11.95 0 top
U$10  47.33,9.72 90 top
U$11  73.66,27.94 90 top
U$13  [MOUNTINGHOLE_2.8]  98.38,3.9 0 top
U$16  28.62,10.75 90 top
U$21  [MOUNTINGHOLE_2.8]  98.92,74.88 0 top
U$30  33.65,1.6 0 top
U$36  32.42,52.3 90 top
V_MOTOR  22.98,12.45 0 top

### Tracks (layer width: path | path; a pad name or v marks a point on that pad's centre or on a via)
+5VSB  (1 unrouted)
  Top 0: 14.62,57.45 14.64,57.47 U$36.P$38
  Top 0.61: 4.02,37.5 IC3.1 4,37.48
  Top 0.813: D4.A 9.73,38.15 4.02,38.15
  Top 1.93: 4.02,37.5 4.02,38.15 4.02,50.42 5.12,51.52 10.43,51.52 13.93,55.02 14.62,55.73 14.62,57.45
A_HIGH  (1 unrouted)
  Top 0.406: 51.6,42.62 51.5,42.73 51.5,50.85 50.8,51.6 45.35,51.6 41.7,55.2 39.08,55.2
  Top 0.6: 39.08,55.2 25.23,55.25
  Top 0.61: 25.23,55.25 25.12,55.25 24.82,55.55 24.82,57.67 J15.14 | IC2.12 51.63,35.31 52.33,36 52.33,41.9 51.6,42.62
A_LOW
  Top 0.1: 37.52,43.98 37.52,43.66 U$36.P$12 37.51,44.17 37.42,44.25
  Top 0.406: 41.3,39.73 41.33,39.75 41.33,45.73 41.33,46.6 39.95,47.98
  Top 0.6: 37.42,44.25 37.42,45.23 J14.12
  Top 0.61: IC2.14 49.09,29 48.45,28.35 45.45,28.35 43.85,29.95 43.85,33.17 42.98,34.05 42.98,35.4 41.3,37.08 41.3,39.73 | 39.95,47.98 37.48,47.98 37.48,47.97 J14.12
B_HIGH  (2 unrouted)
  Top 0: U$36.P$35 22.25,59.23 22.27,59.2 | 34.67,53.67 35.01,53.67 | 36,50.77 36,50.74 J11.1
  Top 0.61: 22.27,59.2 22.27,55.75 24.23,53.8 34.5,53.8 | 34.5,53.8 34.55,53.8 | 36,50.77 35.75,51.02 35.75,52.55 35.75,52.94 35.75,53.33 35.33,53.75 34.55,53.75 34.5,53.8
B_HIGH_J0
  Top 0.05: 36.58,34.27 36.61,34.75 J11.2
  Top 0.406: IC5.12 35.71,33.06
  Top 0.61: 35.71,33.06 36.58,34.27
B_LOW
  Top 0.1: 40.02,42.75 40.02,43.66 U$36.P$13
  Top 0.406: IC5.14 33.17,35.7 34.25,36.77 34.25,38.12 34.33,38.2 36.9,38.2 38.23,38.2 39.9,39.88 39.9,40.17 39.98,40.25
  Top 0.61: 39.98,40.25 J14.13 40.02,42.75
BEMF_PHASE_A
  Top 0.1: 22.27,44.35 U$36.P$6
  Top 0.406: 22.27,45.05 22.27,44.35 | 22.25,46.27 J14.6 | C16.2 24.56,50.85 31.02,50.85 31.15,50.67 31.15,43.17 32.77,41.55 32.77,39.79 R27.2 34.93,39.17 R8.1
  Top 0.61: J14.6 22.25,48.53 C16.2
  Top 0.813: J14.6 22.25,45.07 22.27,45.05
BEMF_PHASE_B
  Top 0: J14.7 24.79,44.21 24.8,44.23
  Top 0.1: U$36.P$7 24.8,44.23 24.82,44.25
  Top 0.61: R11.2 26.62,29.4 25.1,30.93 24.68,31.34 R15.2 24.66,33.33 C12.2 24.66,37.23 24.68,37.25
  Top 1.27: 24.68,37.25 24.68,40.27 24.82,40.42 24.82,42.42 J14.7
BEMF_PHASE_C  (1 unrouted)
  Top 0.406: 27.32,48.58 J14.8 27.32,44.45 | 27.32,48.58 27.32,49.23 R7.2 | 26.62,49.23 C8.2 | 27.32,48.58 25.75,48.58 23.55,46.38 23.55,42.85 22.32,41.62 21.98,41.27 21.88,34.17 20.42,32.72 R20.2
  Top 0.813: 27.32,49.23 26.62,49.23
C_HIGH
  Top 0: J15.16 19.68,59.88 U$36.P$36
  Top 0.406: 13.12,38.95 13.12,43.48 13.38,43.65 13.38,48.5 14.2,49.38 14.2,50.15 19.68,55.62 J15.16
  Top 0.61: IC1.12 12.3,34.1 12.95,34.75 13.07,34.88 13.07,38.9 13.12,38.95
C_LOW
  Top 0: 49.88,37.12 49.88,36.88 J1.1
  Top 0.1: 42.58,43.67 U$36.P$14 42.59,45.27 J14.14
  Top 0.61: 42.58,43.9 42.58,43.67 42.58,41.2 42.58,40.42 45.15,37.85 49.15,37.85 49.88,37.12
C_LOW_J1
  Top 0: 9.72,33.55 9.38,33.89 J1.2
  Top 0.61: IC1.14 9.75,33.15 9.72,33.17 9.72,33.55
DEV_SEL  (2 unrouted)
  Top 0.61: 57.8,2.19 U$30.20 57.78,2.52 57.77,2.52 57.77,8.5 62.67,13.4 62.67,64.8 62.2,65.28 62.02,65.47 49.12,65.47 47.6,63.95 47.6,61.77
GND  (via drill 0.6 pad 1.78)
  Top 0.406: IC5.2 31.93,17.86 C10.1 | IC5.13 34.47,31.08
  other vias: 18.7,50.92 42.38,23.55 30.15,34.8 5.4,29.07 30.4,18.1 48.65,6.1 31.6,5.95 57.38,37.38 46.3,34.85 38.52,52.7 11.62,11.62 26.73,20.23
  pour Bottom: 0,78.74 102.65,78.74 102.65,0 0,0
  pour Top: 102.05,78.1 0.55,78.1 0.5,0.6 102,0.6
HS_FL.SUP_A
  Top 0.406: IC2.7 54.17,20.43 54.73,19.88 54.73,19.12 C15.1 54.55,18.86 D3.C
HS_FL.SUP_B
  Top 0.406: IC5.7 38.25,19.12 D2.C C11.1
HS_FL.SUP_C_
  Top 0.61: IC1.7 14.82,20.3 15.45,19.68 15.45,19.31 C5.1 15.32,17.24 D1.C
N$1
  Top 0.305: 16.38,16.62 16.1,16.35 16.1,12.9 17.16,11.85 18,11.85
  Top 0.406: 16.38,16.62 18.65,16.62
  Top 0.61: U$1.4 18,8.89 18.35,8.55 18.45,8.55 18.45,10.05 | 18.45,10.05 18.45,11.4 18,11.85 | R1.2 18.65,16.62 | R5.2 20.34,10.05 18.45,10.05
N$2
  Top 0: 39.6,12.28 40.09,12.28 J3.2
  Top 0.61: R9.1 39.6,12.28
N$3
  Top 0.61: U$1.2 15.46,7.21 15.28,7.03 12.22,7.03 11.28,7.97 10.54,7.97 R2.2 10.52,6.03 R6.1
N$4
  Top 0.61: IC1.8 18.63,22.12 R1.1
N$5
  Top 0: 5.75,8.18 5.75,8.51
  Top 0.61: R2.1 5.92,8 5.75,8.18 | IC1.1 5.75,20.67 5.75,8.51
N$7
  Top 0.61: R8.2 37.82,37.18 42,33 R23.2
N$8
  Top 0.406: R3.2 19.02,27.36 R20.1
N$9
  Top 0.61: U$16.4 32.08,12.65 32.75,12.65 34.13,12.65 R13.2 36.55,12.29 R9.2
N$10
  Top 0: J3.1 40.35,18.45
  Top 0.61: 40.35,18.45 40.35,19.8 39.52,20.62 IC5.8
N$11
  Top 0.406: U$16.2 32.59,10.12 32.84,10.12 33.83,9.12 33.83,9.09 R14.1 35.49,8.57 R10.2
N$12
  Top 0: 37.67,8.97 37.75,9.05 J4.2
  Top 0.61: R10.1 37.67,7.83 37.67,8.97
N$13
  Top 0.05: 28.82,22.38 28.32,22.18 J4.1
  Top 0.406: 30.32,22.8 28.82,22.38
  Top 0.61: IC5.1 28.88,22.17 30.32,22.8
N$17
  Top 0.406: 51.88,12.62 52.67,13.43 54.23,13.43 54.83,12.82 R25.2 54.89,13 R21.2
  Top 0.61: U$10.4 50.88,11.63 51.88,12.62
N$18
  Top 0.406: R22.2 54.12,15.2 54.15,15.2 54.2,15.25 57.35,15.25 57.46,15.36 R26.1
  Top 0.61: U$10.2 arc90 49.96,9.07 51.77,9.07 53.45,9.07 56.92,12.55 58.38,14 R26.1
N$19
  Top 0.406: IC2.8 56.62,21.1 56.8,19.13
  Top 0.61: R21.1 56.77,17.68 56.8,19.13 56.8,19.38
N$20
  Top 0.406: R22.1 51.36,15.57 R28.2
N$23
  Top 0.406: 46.41,22.43 IC2.1 | 45.73,21.45 45.73,18.5 46.6,17.62 48.07,17.62 R28.1
  Top 0.61: 45.73,21.45 IC2.1
N$25
  Top 0.1: 19.68,44.3 19.73,44.25 U$36.P$5 19.7,43.66 J14.5
N$27
  Top 0: 23.43,29.1 23.16,29.37 J9.1
  Top 0.61: R35.2 23.43,29.09 23.43,29.1
N$33  (1 unrouted)
  Top 0.406: 2,67.58 68.55,67.67 | 66.38,0.55 66.28,67.1
N$34
  Top 0.1: J14.1 9.54,42.78 9.53,42.8 9.53,43.64 U$36.P$1
N$35
  Top 0.1: U$36.P$2 12.11,45.27 J14.2
N$36
  Top 0.1: U$36.P$3 14.64,42.02 J14.3
N$37
  Top 0.1: U$36.P$4 17.18,45.27 J14.4
N$38
  Top 0.1: J14.11 34.95,43.66 U$36.P$11
N$39
  Top 0.1: J14.15 45.1,43.66 U$36.P$15
N$40  (1 unrouted)
N$41
  Top 0.1: J14.17 50.19,43.66 U$36.P$17
N$43  (1 unrouted)
N$44  (1 unrouted)
N$45  (1 unrouted)
N$46  (1 unrouted)
N$48  (1 unrouted)
N$49  (1 unrouted)
N$50  (1 unrouted)
N$51  (1 unrouted)
N$52  (1 unrouted)
N$53  (1 unrouted)
N$54  (1 unrouted)
N$55  (1 unrouted)
PHASE_A
  Top 0.1: R25.1 53.17,10.51 53.17,10.32
  Top 0.406: IC2.6 52.91,19.25 C15.2 52.73,14.72 52.23,14.22 49.58,14.22
  Top 0.61: U$10.8 44.71,8.07 U$10.7 46.74,9.09 | 48.01,10.36 48.12,10.36 | 48.12,10.36 U$10.3 49.96,10.38 53.08,10.38 R25.1 | IC2.6 52.91,24.97 44.75,24.98 44.21,25.2 R23.1 | 48.12,10.36 47.62,10.86 47.67,11.5 47.67,12.32 48.73,13.38 49.58,14.22 | U$30.16 U$30.15
  Top 0.813: 46.74,9.09 48.01,10.36
  Top 1.016: U$30.15 46.35,2.17
  Top 1.778: PHASE_C.1 44.9,7.88 44.71,8.07
  Top 2.54: 46.35,2.17 44.83,8.03 PHASE_C.1
PHASE_B  (1 unrouted)
  Top 0.61: U$16.8 U$16.7 27.94,10.12 | 29.23,11.4 31.23,11.4 U$16.3 32.8,11.38 33.83,11.38 34.3,10.91 R13.1 | U$30.9 U$30.8 28.6,2.17
  Top 0.813: 27.94,10.12 29.23,11.4
  Top 1.016: 25.95,9.32 25.43,8.97 25.25,7.28 25.65,6.67 24.8,7.38 26.38,6.25 25.07,7.65 26.18,6.15 27.5,7.08 27.52,9.95
  Top 2.184: U$16.8 25.98,8.07 25.95,9.32 | 28.6,2.17 28.45,2.33 28.48,4.97 25.62,7.03 26.38,6.25
PHASE_BJ
  Top 0: 26.07,23.6 26.12,23.55 J5.1
  Top 0.406: IC5.6 36.98,19.86 36.6,19.48 36.6,17.42 C11.2
  Top 0.61: 27.44,25.02 R11.1 | IC5.6 37.01,22.38 36.95,25.02 27.44,25.02 | 27.44,25.02 26.07,23.66 26.07,23.6
PHASE_C
  Top 0.254: 14,14.77 U$1.7
  Top 0.406: 14,14.77 13.31,15.46 13.31,19.15 C5.2
  Top 0.61: R3.1 17.72,24.27 14.25,24.27 13.55,23.58 IC1.6 13.55,19.45 C5.2 | 14.25,14.45 U$1.7 15.47,14.56 15.47,11.8 16.68,10.6 16.68,10.57 16.73,10.53 16.73,9.34 | 16.73,9.34 U$1.3 | 16.73,9.34 16.73,7.45 17.15,7.03 | 20.5,5.17 20.5,6.55 R5.1
  Top 1.016: 17.15,7.03 17.25,7.03 19.43,4.85 20.82,4.85 | 20.48,5.17 20.5,5.17 20.82,4.85 | 20.82,4.85 20.9,4.78 20.9,2.15 | 20.9,2.15 19.7,2.15 U$30.5 | 20.9,2.15 22.2,2.15 U$30.6
  Top 1.676: U$1.8 14,14.77
RXD  (1 unrouted)
  Top 0: 42.58,59.3 U$36.P$27
  Top 0.61: 42.58,59.3 42.6,59.27 42.6,56.08 43.92,54.75 45.45,54.75 46.95,54.75 48.98,52.73 59.88,52.73 60.33,52.27 60.33,41.77 60.23,14.2 52.7,6.67 U$30.18
SENSE_CURRENT_PA5
  Top 0: J14.10 32.42,46.82 U$36.P$10
SENSE_VIN  (1 unrouted)
  Top 0: 29.02,38.9 29.01,38.89 J9.2
  Top 0.1: 29.88,44.4 29.88,43.69 U$36.P$9
  Top 0.61: R36.1 29.93,44.45 29.88,44.4
  Top 0.813: J14.9 29.86,40.44 29.45,40.02 29.02,39.6 29.02,38.9
TXD  (1 unrouted)
  Top 0.61: J15.6 46.04,57.73 47.88,55.9 49.77,54 60.08,54 60.08,53.98 61.45,52.6 61.45,13.72 55.24,7.51 U$30.19
V_MOTOR  (5 unrouted)
  Top 0: 20.82,16.12 20.62,15.12 | 43.8,11.8 43.42,11.8 43.38,11.85
  Top 0.305: 46.45,16.57 50.17,16.57
  Top 0.406: 17.15,25.73 19.95,25.73 | IC1.3 9.74,24.83 | IC5.3 33.2,20.14 C10.2 | C14.2 49.75,19.5 | 50.9,18.35 50.9,17.3 D3.A 50.2,16.6 50.17,16.57 | U$30.14 41.25,2.17 | 46.33,16.45 46.45,16.57
  Top 0.61: 19.95,25.73 20.6,25.73 20.77,25.85 | 20.77,25.85 20.75,17 20.76,16.73 | C1.2 C13.2 25.32,15 25.4,14.92 | 26.85,13.9 26.35,14.9 | IC2.3 49.09,19.72 C14.2 | 8.85,25.73 17.15,25.73 | R35.1 24.07,25.12 20.77,25.85 | IC1.3 9.74,19.66 C4.2 9.61,19.01 D1.A | U$1.6 U$1.5 | C10.2 33.41,19.64 D2.A | 49.75,19.5 50.9,18.35 | 43.9,17.75 43.38,11.85 | U$10.5 44.71,11.35 | 44.71,11.35 U$10.6 | 44.85,12.35 45.61,12.25 44.71,11.35 | U$30.14 U$30.13 | U$16.6 26.02,11.4 26.02,12.03 | 20.76,16.73 20.77,16.18 20.82,16.12 | 20.99,12.69 20.76,12.92 20.76,16.73 | IC3.3 3.59,28.4 3.59,27.41 5.28,25.73 8.85,25.73 | 9.74,24.83 8.85,25.73 | 46.33,16.45 46.1,16.23 45.17,16.23
  Top 0.813: D2.A 34.1,18.27 34.1,14.95 | C6.1 43.43,17.56 43.91,17.56
  Top 1.422: 44.26,12.53 44.1,14.8 45.38,12.28 45.38,10.78 45.23,10.93 45.17,16.23 42.1,16.23 43.05,16.02 43,11.85 44.2,11.8 43.8,11.8
  Top 1.676: 41.73,9.9 41.73,10.53 45.2,13.8 45.17,16.23
  Top 1.93: 26.02,12.03 26.05,12.05 26.05,14.57
  Top 2.184: 25.11,14.93 25.4,14.92 26.35,14.9 32.85,14.96 34.1,14.95 40.7,14.95 43.98,14.93 43.91,17.56 43.9,17.75 | 41.25,2.17 41.15,2.17 41.2,4.72 41.2,5.58 41.7,9.22 41.73,9.9 | U$1.5 20.99,12.69 V_MOTOR.1 25.8,12.45 U$16.5
VCC3.3V  (1 unrouted)
VDD_LOGIC_5V
  Top 0.406: 30.77,27.35 30.09,26.66 C9.2 28.84,26.62 23.82,26.62 23.25,26.62 21.5,28.38 18.82,28.38 | 45.45,26.2 43.45,28.48 43.17,28.5 40.65,28.5 37.03,28.5 36.98,28.45
  Top 0.61: IC5.11 36.98,28.45 36.98,28.28 36.05,27.35 | 45.45,26.2 52.45,26.23 52.91,26.68 IC2.11 52.91,34.12 C20.2 | D4.C 16.67,35.9 16.82,35.9 15.71,34.78 C3.2 14.15,33.75 13.55,33.16 IC1.11 13.55,29.97 15.15,28.38 18.82,28.38
  Top 0.8: 36.05,27.35 30.77,27.35